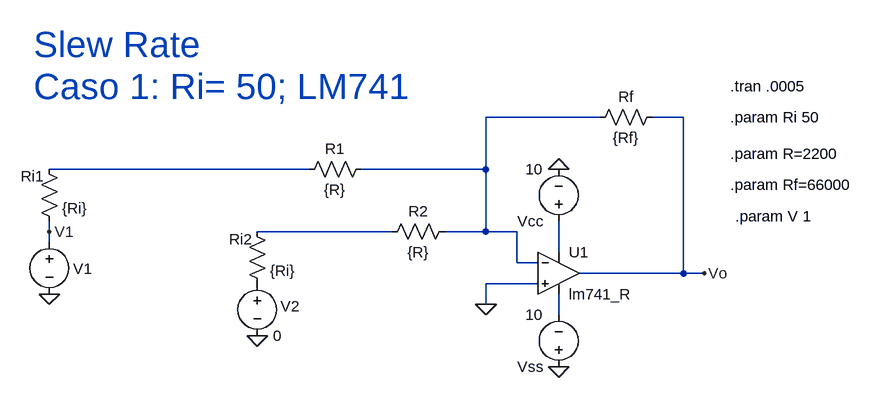
[diagram p0: schematic Caso 1.1 - LM741 - Slew Rate.asc]
Caso 1.1 - LM741 - Slew Rate.asc, the LTspice schematic file:
Version 4
SHEET 1 968 1072
WIRE 560 352 384 352
WIRE 688 352 640 352
WIRE 112 432 -288 432
WIRE 384 432 384 352
WIRE 384 432 192 432
WIRE -288 528 -288 512
WIRE 240 528 32 528
WIRE 384 528 384 432
WIRE 384 528 320 528
WIRE 432 528 384 528
WIRE -288 544 -288 528
WIRE 496 560 496 512
WIRE 432 576 432 528
WIRE 464 576 432 576
WIRE 688 592 688 352
WIRE 688 592 528 592
WIRE 720 592 688 592
WIRE 464 608 384 608
WIRE 384 640 384 608
WIRE 496 656 496 624
FLAG -288 624 0
FLAG 32 688 0
FLAG 384 640 0
FLAG 720 592 Vo
FLAG 496 432 0
FLAG 496 736 0
FLAG -288 528 V1
SYMBOL res 208 416 R90
WINDOW 0 0 56 VBottom 2
WINDOW 3 32 56 VTop 2
SYMATTR InstName R1
SYMATTR Value {R}
SYMBOL res 336 512 R90
WINDOW 0 0 56 VBottom 2
WINDOW 3 32 56 VTop 2
SYMATTR InstName R2
SYMATTR Value {R}
SYMBOL voltage -288 528 R0
WINDOW 0 37 57 Left 2
WINDOW 123 0 0 Left 0
WINDOW 39 0 0 Left 0
WINDOW 3 24 96 Invisible 2
SYMATTR InstName V1
SYMATTR Value PULSE(-10m 10m 50u .1p .1p .1m .2m 10)
SYMBOL voltage 32 592 R0
WINDOW 0 36 51 Left 2
WINDOW 123 0 0 Left 0
WINDOW 39 0 0 Left 0
SYMATTR InstName V2
SYMATTR Value 0
SYMBOL res 656 336 R90
WINDOW 0 0 56 VBottom 2
WINDOW 3 32 56 VTop 2
SYMATTR InstName Rf
SYMATTR Value {Rf}
SYMBOL voltage 496 752 R180
WINDOW 123 0 0 Left 0
WINDOW 39 0 0 Left 0
SYMATTR InstName Vss
SYMATTR Value 10
SYMBOL voltage 496 528 R180
WINDOW 123 0 0 Left 0
WINDOW 39 0 0 Left 0
SYMATTR InstName Vcc
SYMATTR Value 10
SYMBOL res -304 416 R0
WINDOW 0 -28 27 Left 2
SYMATTR InstName Ri1
SYMATTR Value {Ri}
SYMBOL res 16 512 R0
WINDOW 0 -27 28 Left 2
SYMATTR InstName Ri2
SYMATTR Value {Ri}
SYMBOL ZZZ\\OpAmp\\lm741_R 496 528 R0
SYMATTR InstName U1
TEXT 760 304 Left 2 !.tran .0005
TEXT 760 352 Left 2 !.param Ri 50
TEXT 760 408 Left 2 !.param R=2200
TEXT 760 456 Left 2 !.param Rf=66000
TEXT 768 504 Left 2 !.param V 1
TEXT -312 304 Left 5 ;Caso 1: Ri= 50; LM741
TEXT -312 240 Left 5 ;Slew Rate

The netlist it stands for:
* Caso 1.1 - LM741 - Slew Rate.asc
R1 N001 N002 {R}
R2 N001 N003 {R}
V1 V1 0 PULSE(-10m 10m 50u .1p .1p .1m .2m 10)
V2 P001 0 0
Rf Vo N001 {Rf}
Vss 0 N005 10
Vcc N004 0 10
Ri1 N002 V1 {Ri}
Ri2 N003 P001 {Ri}
* U1: lm741_R (symbol ZZZ\OpAmp\lm741_R not available, pins judged from their places): In+=0 In-=N001 V+=N004 V-=N005 OUT=Vo
.tran .0005
.param Ri 50
.param R=2200
.param Rf=66000
.param V 1
* Caso 1: Ri= 50; LM741
* Slew Rate
.backanno
.end